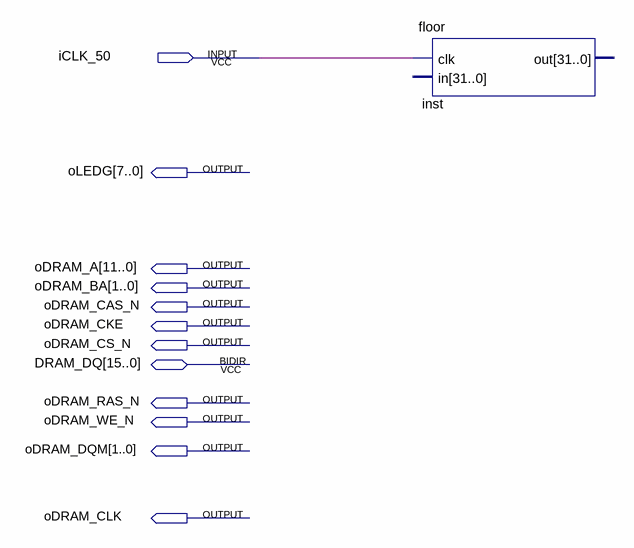
[diagram p0: schematic sheet]
// Quartus schematic FloorTest.bdf as structural Verilog: 1 symbols, 12 pins
module FloorTest (
  input  iCLK_50,
  inout  [15:0] DRAM_DQ,
  output [7:0] oLEDG,
  output [11:0] oDRAM_A,
  output [1:0] oDRAM_BA,
  output oDRAM_CAS_N,
  output oDRAM_CKE,
  output oDRAM_CS_N,
  output oDRAM_RAS_N,
  output oDRAM_WE_N,
  output [1:0] oDRAM_DQM,
  output oDRAM_CLK
);

  floor inst (.clk(iCLK_50));  // open: in, out
endmodule
